# EAGLE design module_bga (EAGLE 9.3.0)

## Sheet 1 of 3
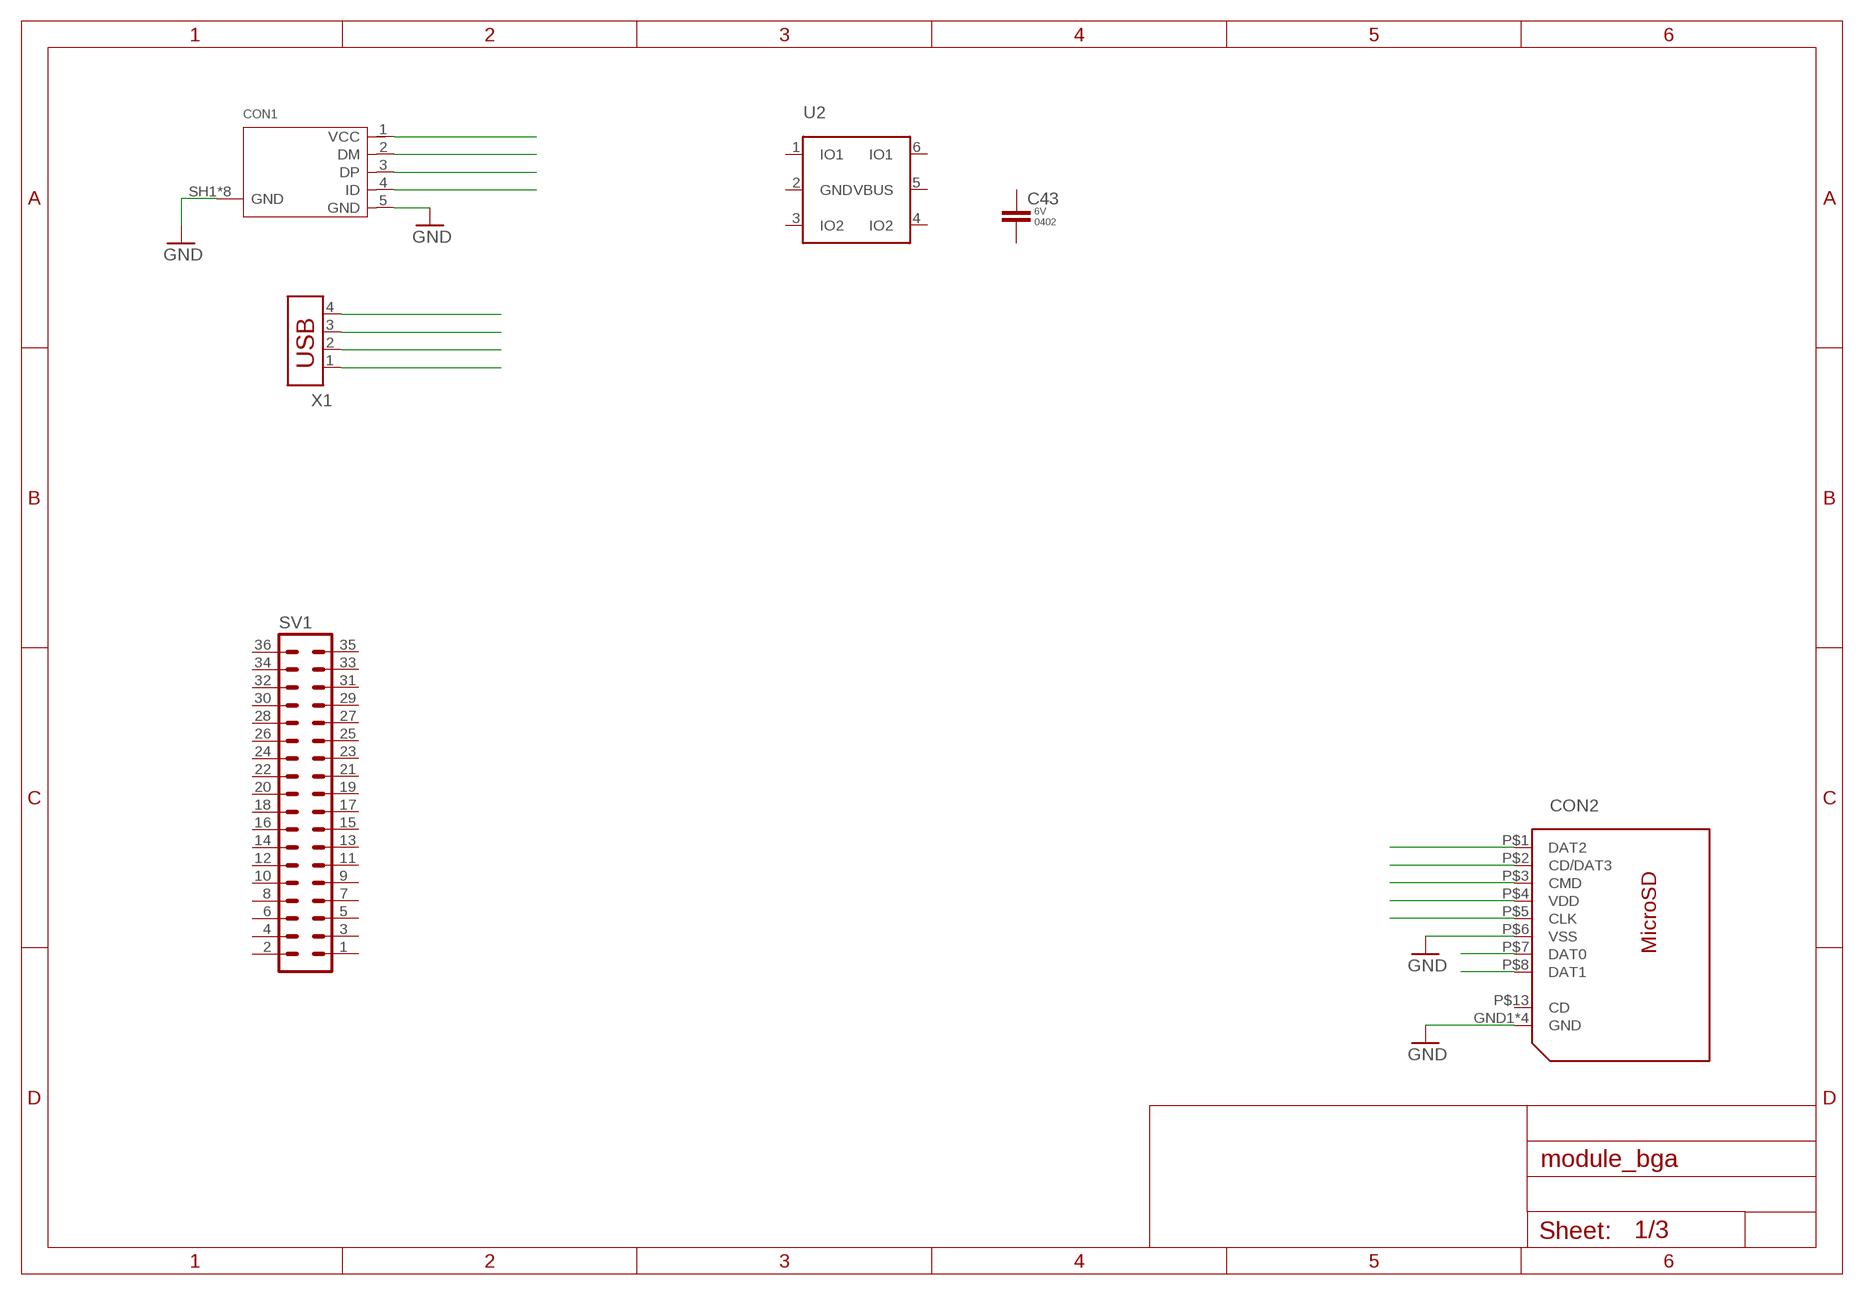
[diagram p0: schematic, sheet 1]

### Parts
C43  CAP-0402  [C0402K]
CON1  10118194-0001LF  [10118194]
CON2  112J-TXAR  [112J]
SV1  MA18-2  [MA18-2]
U2  USBLC6-2SC6  [SOT95P280X110-6]
X1  USB-787616  [USB]

### Nets
DAT0@7: CON2.P$7(DAT0)
DAT1@8: CON2.P$8(DAT1)
GND: CON1.5(GND) CON1.SH1(GND) CON1.SH2(GND) CON1.SH3(GND) CON1.SH4(GND) CON1.SH5(GND) CON1.SH6(GND) CON1.SH7(GND) CON1.SH8(GND) CON2.GND1(GND) CON2.GND2(GND) CON2.GND3(GND) CON2.GND4(GND) CON2.P$6(VSS) ; also sheet 2,3
N$4: CON1.4(ID)
N$5: CON1.3(DP)
N$6: CON1.2(DM)
N$7: CON1.1(VCC)
N$8: X1.1
N$9: X1.2
N$10: X1.3
N$11: X1.4
N$12: CON2.P$4(VDD)
N$13: CON2.P$1(DAT2)
N$14: CON2.P$2(CD/DAT3)
N$15: CON2.P$3(CMD)
N$16: CON2.P$5(CLK)
Unconnected: C43.1 C43.2 CON2.P$13(CD) SV1.1 SV1.2 SV1.3 SV1.4 SV1.5 SV1.6 SV1.7 SV1.8 SV1.9 SV1.10 SV1.11 SV1.12 SV1.13 SV1.14 SV1.15 SV1.16 SV1.17 SV1.18 SV1.19 SV1.20 SV1.21 SV1.22 SV1.23 SV1.24 SV1.25 SV1.26 SV1.27 SV1.28 SV1.29 SV1.30 SV1.31 SV1.32 SV1.33 SV1.34 SV1.35 SV1.36 U2.1(IO1) U2.2(GND) U2.3(IO2) U2.4(IO2) U2.5(VBUS) U2.6(IO1)

## Sheet 2 of 3
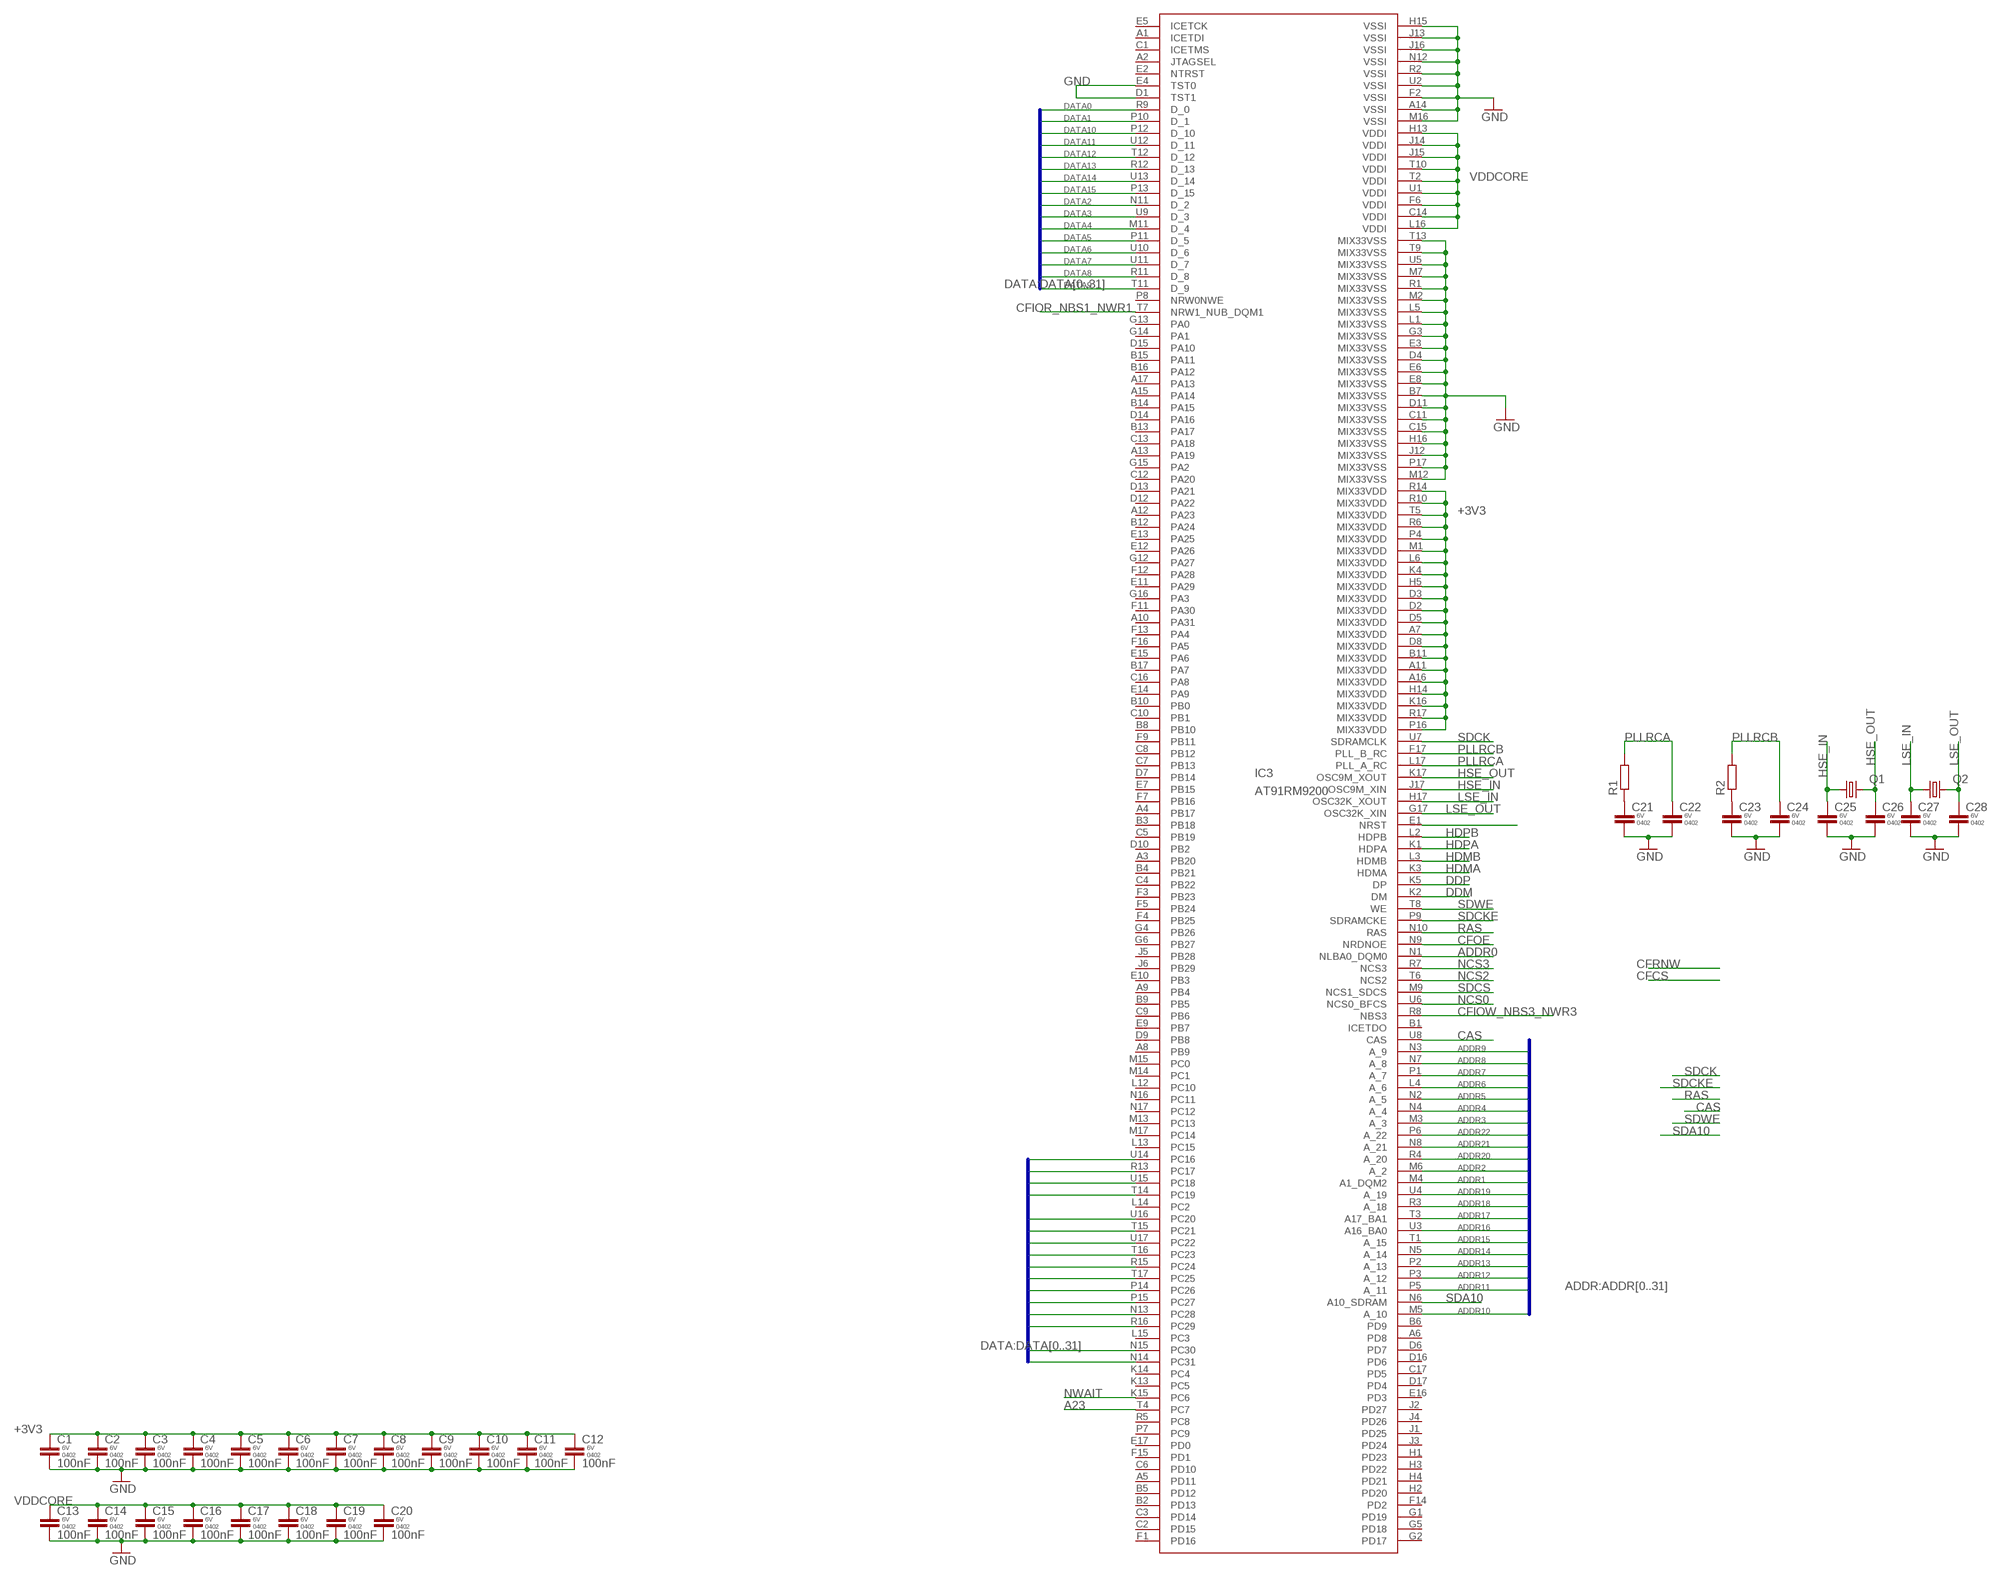
[diagram p1: schematic, sheet 2]

### Parts
C1  100nF  CAP-0402  [C0402K]
C2  100nF  CAP-0402  [C0402K]
C3  100nF  CAP-0402  [C0402K]
C4  100nF  CAP-0402  [C0402K]
C5  100nF  CAP-0402  [C0402K]
C6  100nF  CAP-0402  [C0402K]
C7  100nF  CAP-0402  [C0402K]
C8  100nF  CAP-0402  [C0402K]
C9  100nF  CAP-0402  [C0402K]
C10  100nF  CAP-0402  [C0402K]
C11  100nF  CAP-0402  [C0402K]
C12  100nF  CAP-0402  [C0402K]
C13  100nF  CAP-0402  [C0402K]
C14  100nF  CAP-0402  [C0402K]
C15  100nF  CAP-0402  [C0402K]
C16  100nF  CAP-0402  [C0402K]
C17  100nF  CAP-0402  [C0402K]
C18  100nF  CAP-0402  [C0402K]
C19  100nF  CAP-0402  [C0402K]
C20  100nF  CAP-0402  [C0402K]
C21  CAP-0402  [C0402K]
C22  CAP-0402  [C0402K]
C23  CAP-0402  [C0402K]
C24  CAP-0402  [C0402K]
C25  CAP-0402  [C0402K]
C26  CAP-0402  [C0402K]
C27  CAP-0402  [C0402K]
C28  CAP-0402  [C0402K]
IC3  AT91RM9200  [LFBGA256_A_291X326]
Q1  KX-7  [3.2X2.5_KX-7]
Q2  KX-327-NHF  [3.2X1.5]
R1  R-EU_R0402  [R0402]
R2  R-EU_R0402  [R0402]

### Nets
+3V3: C1.1 C2.1 C3.1 C4.1 C5.1 C6.1 C7.1 C8.1 C9.1 C10.1 C11.1 C12.1 IC3.A7(MIX33VDD) IC3.A11(MIX33VDD) IC3.A16(MIX33VDD) IC3.B11(MIX33VDD) IC3.D2(MIX33VDD) IC3.D3(MIX33VDD) IC3.D5(MIX33VDD) IC3.D8(MIX33VDD) IC3.H5(MIX33VDD) IC3.H14(MIX33VDD) IC3.K4(MIX33VDD) IC3.K16(MIX33VDD) IC3.L6(MIX33VDD) IC3.M1(MIX33VDD) IC3.P4(MIX33VDD) IC3.P16(MIX33VDD) IC3.R6(MIX33VDD) IC3.R10(MIX33VDD) IC3.R14(MIX33VDD) IC3.R17(MIX33VDD) IC3.T5(MIX33VDD) ; also sheet 3
A23: IC3.T4(PC7)
ADDR0: IC3.N1(NLBA0_DQM0) ; also sheet 3
ADDR1: IC3.M4(A1_DQM2) ; also sheet 3
ADDR2: IC3.M6(A_2) ; also sheet 3
ADDR3: IC3.M3(A_3) ; also sheet 3
ADDR4: IC3.N4(A_4) ; also sheet 3
ADDR5: IC3.N2(A_5) ; also sheet 3
ADDR6: IC3.L4(A_6) ; also sheet 3
ADDR7: IC3.P1(A_7) ; also sheet 3
ADDR8: IC3.N7(A_8) ; also sheet 3
ADDR9: IC3.N3(A_9) ; also sheet 3
ADDR10: IC3.M5(A_10) ; also sheet 3
ADDR11: IC3.P5(A_11) ; also sheet 3
ADDR12: IC3.P3(A_12)
ADDR13: IC3.P2(A_13) ; also sheet 3
ADDR14: IC3.N5(A_14) ; also sheet 3
ADDR15: IC3.T1(A_15)
ADDR16: IC3.U3(A16_BA0) ; also sheet 3
ADDR17: IC3.T3(A17_BA1) ; also sheet 3
ADDR18: IC3.R3(A_18)
ADDR19: IC3.U4(A_19)
ADDR20: IC3.R4(A_20)
ADDR21: IC3.N8(A_21)
ADDR22: IC3.P6(A_22)
CAS: IC3.U8(CAS) ; also sheet 3
CFIOR_NBS1_NWR1: IC3.T7(NRW1_NUB_DQM1) ; also sheet 3
CFIOW_NBS3_NWR3: IC3.R8(NBS3) ; also sheet 3
CFOE: IC3.N9(NRDNOE)
DATA0: IC3.R9(D_0) ; also sheet 3
DATA1: IC3.P10(D_1) ; also sheet 3
DATA2: IC3.N11(D_2) ; also sheet 3
DATA3: IC3.U9(D_3) ; also sheet 3
DATA4: IC3.M11(D_4) ; also sheet 3
DATA5: IC3.P11(D_5) ; also sheet 3
DATA6: IC3.U10(D_6) ; also sheet 3
DATA7: IC3.U11(D_7) ; also sheet 3
DATA8: IC3.R11(D_8) ; also sheet 3
DATA9: IC3.T11(D_9) ; also sheet 3
DATA10: IC3.P12(D_10) ; also sheet 3
DATA11: IC3.U12(D_11) ; also sheet 3
DATA12: IC3.T12(D_12) ; also sheet 3
DATA13: IC3.R12(D_13) ; also sheet 3
DATA14: IC3.U13(D_14) ; also sheet 3
DATA15: IC3.P13(D_15) ; also sheet 3
DATA16: IC3.U14(PC16) ; also sheet 3
DATA17: IC3.R13(PC17) ; also sheet 3
DATA18: IC3.U15(PC18) ; also sheet 3
DATA19: IC3.T14(PC19) ; also sheet 3
DATA20: IC3.U16(PC20) ; also sheet 3
DATA21: IC3.T15(PC21) ; also sheet 3
DATA22: IC3.U17(PC22) ; also sheet 3
DATA23: IC3.T16(PC23) ; also sheet 3
DATA24: IC3.R15(PC24) ; also sheet 3
DATA25: IC3.T17(PC25) ; also sheet 3
DATA26: IC3.P14(PC26) ; also sheet 3
DATA27: IC3.P15(PC27) ; also sheet 3
DATA28: IC3.N13(PC28) ; also sheet 3
DATA29: IC3.R16(PC29) ; also sheet 3
DATA30: IC3.N15(PC30) ; also sheet 3
DATA31: IC3.N14(PC31) ; also sheet 3
DDM: IC3.K2(DM)
DDP: IC3.K5(DP)
GND: C1.2 C2.2 C3.2 C4.2 C5.2 C6.2 C7.2 C8.2 C9.2 C10.2 C11.2 C12.2 C13.2 C14.2 C15.2 C16.2 C17.2 C18.2 C19.2 C20.2 C21.2 C22.2 C23.2 C24.2 C25.2 C26.2 C27.2 C28.2 IC3.A14(VSSI) IC3.B7(MIX33VSS) IC3.C11(MIX33VSS) IC3.C15(MIX33VSS) IC3.D1(TST1) IC3.D4(MIX33VSS) IC3.D11(MIX33VSS) IC3.E3(MIX33VSS) IC3.E4(TST0) IC3.E6(MIX33VSS) IC3.E8(MIX33VSS) IC3.F2(VSSI) IC3.G3(MIX33VSS) IC3.H15(VSSI) IC3.H16(MIX33VSS) IC3.J12(MIX33VSS) IC3.J13(VSSI) IC3.J16(VSSI) IC3.L1(MIX33VSS) IC3.L5(MIX33VSS) IC3.M2(MIX33VSS) IC3.M7(MIX33VSS) IC3.M12(MIX33VSS) IC3.M16(VSSI) IC3.N12(VSSI) IC3.P17(MIX33VSS) IC3.R1(MIX33VSS) IC3.R2(VSSI) IC3.T9(MIX33VSS) IC3.T13(MIX33VSS) IC3.U2(VSSI) IC3.U5(MIX33VSS) ; also sheet 1,3
HDMA: IC3.K3(HDMA)
HDMB: IC3.L3(HDMB)
HDPA: IC3.K1(HDPA)
HDPB: IC3.L2(HDPB)
HSE_IN: C25.1 IC3.J17(OSC9M_XIN) Q1.1
HSE_OUT: C26.1 IC3.K17(OSC9M_XOUT) Q1.3
LSE_IN: C27.1 IC3.H17(OSC32K_XOUT) Q2.1
LSE_OUT: C28.1 IC3.G17(OSC32K_XIN) Q2.2
N$1: C21.1 R1.1
N$2: C23.1 R2.1
N$3: IC3.E1(NRST)
NCS0: IC3.U6(NCS0_BFCS)
NCS2: IC3.T6(NCS2)
NCS3: IC3.R7(NCS3)
NWAIT: IC3.K15(PC6)
PLLRCA: C22.1 IC3.L17(PLL_A_RC) R1.2
PLLRCB: C24.1 IC3.F17(PLL_B_RC) R2.2
RAS: IC3.N10(RAS) ; also sheet 3
SDA10: IC3.N6(A10_SDRAM) ; also sheet 3
SDCK: IC3.U7(SDRAMCLK) ; also sheet 3
SDCKE: IC3.P9(SDRAMCKE) ; also sheet 3
SDCS: IC3.M9(NCS1_SDCS) ; also sheet 3
SDWE: IC3.T8(WE) ; also sheet 3
VDDCORE: C13.1 C14.1 C15.1 C16.1 C17.1 C18.1 C19.1 C20.1 IC3.C14(VDDI) IC3.F6(VDDI) IC3.H13(VDDI) IC3.J14(VDDI) IC3.J15(VDDI) IC3.L16(VDDI) IC3.T2(VDDI) IC3.T10(VDDI) IC3.U1(VDDI)
Unconnected: IC3.A1(ICETDI) IC3.A2(JTAGSEL) IC3.A3(PB20) IC3.A4(PB17) IC3.A5(PD11) IC3.A6(PD8) IC3.A8(PB9) IC3.A9(PB4) IC3.A10(PA31) IC3.A12(PA23) IC3.A13(PA19) IC3.A15(PA14) IC3.A17(PA13) IC3.B1(ICETDO) IC3.B2(PD13) IC3.B3(PB18) IC3.B4(PB21) IC3.B5(PD12) IC3.B6(PD9) IC3.B8(PB10) IC3.B9(PB5) IC3.B10(PB0) IC3.B12(PA24) IC3.B13(PA17) IC3.B14(PA15) IC3.B15(PA11) IC3.B16(PA12) IC3.B17(PA7) IC3.C1(ICETMS) IC3.C2(PD15) IC3.C3(PD14) IC3.C4(PB22) IC3.C5(PB19) IC3.C6(PD10) IC3.C7(PB13) IC3.C8(PB12) IC3.C9(PB6) IC3.C10(PB1) IC3.C12(PA20) IC3.C13(PA18) IC3.C16(PA8) IC3.C17(PD5) IC3.D6(PD7) IC3.D7(PB14) IC3.D9(PB8) IC3.D10(PB2) IC3.D12(PA22) IC3.D13(PA21) IC3.D14(PA16) IC3.D15(PA10) IC3.D16(PD6) IC3.D17(PD4) IC3.E2(NTRST) IC3.E5(ICETCK) IC3.E7(PB15) IC3.E9(PB7) IC3.E10(PB3) IC3.E11(PA29) IC3.E12(PA26) IC3.E13(PA25) IC3.E14(PA9) IC3.E15(PA6) IC3.E16(PD3) IC3.E17(PD0) IC3.F1(PD16) IC3.F3(PB23) IC3.F4(PB25) IC3.F5(PB24) IC3.F7(PB16) IC3.F9(PB11) IC3.F11(PA30) IC3.F12(PA28) IC3.F13(PA4) IC3.F14(PD2) IC3.F15(PD1) IC3.F16(PA5) IC3.G1(PD19) IC3.G2(PD17) IC3.G4(PB26) IC3.G5(PD18) IC3.G6(PB27) IC3.G12(PA27) IC3.G13(PA0) IC3.G14(PA1) IC3.G15(PA2) IC3.G16(PA3) IC3.H1(PD23) IC3.H2(PD20) IC3.H3(PD22) IC3.H4(PD21) IC3.J1(PD25) IC3.J2(PD27) IC3.J3(PD24) IC3.J4(PD26) IC3.J5(PB28) IC3.J6(PB29) IC3.K13(PC5) IC3.K14(PC4) IC3.L12(PC10) IC3.L13(PC15) IC3.L14(PC2) IC3.L15(PC3) IC3.M13(PC13) IC3.M14(PC1) IC3.M15(PC0) IC3.M17(PC14) IC3.N16(PC11) IC3.N17(PC12) IC3.P7(PC9) IC3.P8(NRW0NWE) IC3.R5(PC8)

### Buses
ADDR:ADDR[0..31]
DATA:DATA[0..31]

## Sheet 3 of 3
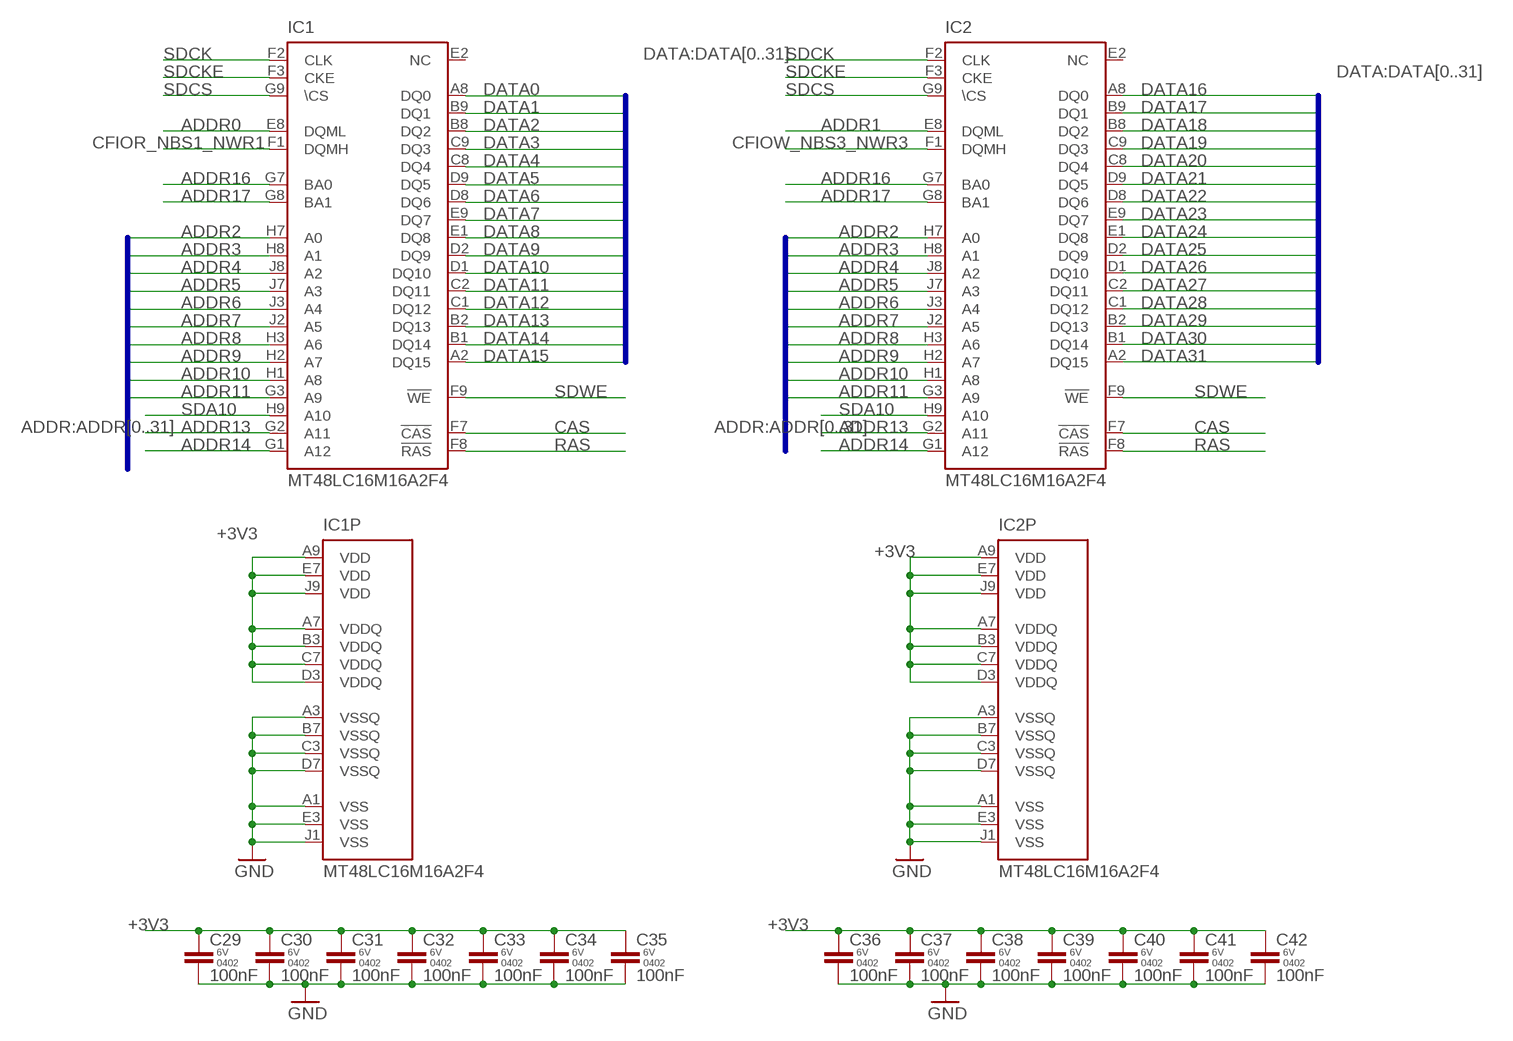
[diagram p2: schematic, sheet 3]

### Parts
C29  100nF  CAP-0402  [C0402K]
C30  100nF  CAP-0402  [C0402K]
C31  100nF  CAP-0402  [C0402K]
C32  100nF  CAP-0402  [C0402K]
C33  100nF  CAP-0402  [C0402K]
C34  100nF  CAP-0402  [C0402K]
C35  100nF  CAP-0402  [C0402K]
C36  100nF  CAP-0402  [C0402K]
C37  100nF  CAP-0402  [C0402K]
C38  100nF  CAP-0402  [C0402K]
C39  100nF  CAP-0402  [C0402K]
C40  100nF  CAP-0402  [C0402K]
C41  100nF  CAP-0402  [C0402K]
C42  100nF  CAP-0402  [C0402K]
IC1  MT48LC16M16A2F4  [BGA81C80P9X9_800X800X100]
IC2  MT48LC16M16A2F4  [BGA81C80P9X9_800X800X100]

### Nets
+3V3: C29.1 C30.1 C31.1 C32.1 C33.1 C34.1 C35.1 C36.1 C37.1 C38.1 C39.1 C40.1 C41.1 C42.1 IC1.A7(VDDQ) IC1.A9(VDD) IC1.B3(VDDQ) IC1.C7(VDDQ) IC1.D3(VDDQ) IC1.E7(VDD) IC1.J9(VDD) IC2.A7(VDDQ) IC2.A9(VDD) IC2.B3(VDDQ) IC2.C7(VDDQ) IC2.D3(VDDQ) IC2.E7(VDD) IC2.J9(VDD) ; also sheet 2
ADDR0: IC1.E8(DQML) ; also sheet 2
ADDR1: IC2.E8(DQML) ; also sheet 2
ADDR2: IC1.H7(A0) IC2.H7(A0) ; also sheet 2
ADDR3: IC1.H8(A1) IC2.H8(A1) ; also sheet 2
ADDR4: IC1.J8(A2) IC2.J8(A2) ; also sheet 2
ADDR5: IC1.J7(A3) IC2.J7(A3) ; also sheet 2
ADDR6: IC1.J3(A4) IC2.J3(A4) ; also sheet 2
ADDR7: IC1.J2(A5) IC2.J2(A5) ; also sheet 2
ADDR8: IC1.H3(A6) IC2.H3(A6) ; also sheet 2
ADDR9: IC1.H2(A7) IC2.H2(A7) ; also sheet 2
ADDR10: IC1.H1(A8) IC2.H1(A8) ; also sheet 2
ADDR11: IC1.G3(A9) IC2.G3(A9) ; also sheet 2
ADDR13: IC1.G2(A11) IC2.G2(A11) ; also sheet 2
ADDR14: IC1.G1(A12) IC2.G1(A12) ; also sheet 2
ADDR16: IC1.G7(BA0) IC2.G7(BA0) ; also sheet 2
ADDR17: IC1.G8(BA1) IC2.G8(BA1) ; also sheet 2
CAS: IC1.F7(!CAS) IC2.F7(!CAS) ; also sheet 2
CFIOR_NBS1_NWR1: IC1.F1(DQMH) ; also sheet 2
CFIOW_NBS3_NWR3: IC2.F1(DQMH) ; also sheet 2
DATA0: IC1.A8(DQ0) ; also sheet 2
DATA1: IC1.B9(DQ1) ; also sheet 2
DATA2: IC1.B8(DQ2) ; also sheet 2
DATA3: IC1.C9(DQ3) ; also sheet 2
DATA4: IC1.C8(DQ4) ; also sheet 2
DATA5: IC1.D9(DQ5) ; also sheet 2
DATA6: IC1.D8(DQ6) ; also sheet 2
DATA7: IC1.E9(DQ7) ; also sheet 2
DATA8: IC1.E1(DQ8) ; also sheet 2
DATA9: IC1.D2(DQ9) ; also sheet 2
DATA10: IC1.D1(DQ10) ; also sheet 2
DATA11: IC1.C2(DQ11) ; also sheet 2
DATA12: IC1.C1(DQ12) ; also sheet 2
DATA13: IC1.B2(DQ13) ; also sheet 2
DATA14: IC1.B1(DQ14) ; also sheet 2
DATA15: IC1.A2(DQ15) ; also sheet 2
DATA16: IC2.A8(DQ0) ; also sheet 2
DATA17: IC2.B9(DQ1) ; also sheet 2
DATA18: IC2.B8(DQ2) ; also sheet 2
DATA19: IC2.C9(DQ3) ; also sheet 2
DATA20: IC2.C8(DQ4) ; also sheet 2
DATA21: IC2.D9(DQ5) ; also sheet 2
DATA22: IC2.D8(DQ6) ; also sheet 2
DATA23: IC2.E9(DQ7) ; also sheet 2
DATA24: IC2.E1(DQ8) ; also sheet 2
DATA25: IC2.D2(DQ9) ; also sheet 2
DATA26: IC2.D1(DQ10) ; also sheet 2
DATA27: IC2.C2(DQ11) ; also sheet 2
DATA28: IC2.C1(DQ12) ; also sheet 2
DATA29: IC2.B2(DQ13) ; also sheet 2
DATA30: IC2.B1(DQ14) ; also sheet 2
DATA31: IC2.A2(DQ15) ; also sheet 2
GND: C29.2 C30.2 C31.2 C32.2 C33.2 C34.2 C35.2 C36.2 C37.2 C38.2 C39.2 C40.2 C41.2 C42.2 IC1.A1(VSS) IC1.A3(VSSQ) IC1.B7(VSSQ) IC1.C3(VSSQ) IC1.D7(VSSQ) IC1.E3(VSS) IC1.J1(VSS) IC2.A1(VSS) IC2.A3(VSSQ) IC2.B7(VSSQ) IC2.C3(VSSQ) IC2.D7(VSSQ) IC2.E3(VSS) IC2.J1(VSS) ; also sheet 1,2
RAS: IC1.F8(!RAS) IC2.F8(!RAS) ; also sheet 2
SDA10: IC1.H9(A10) IC2.H9(A10) ; also sheet 2
SDCK: IC1.F2(CLK) IC2.F2(CLK) ; also sheet 2
SDCKE: IC1.F3(CKE) IC2.F3(CKE) ; also sheet 2
SDCS: IC1.G9(\CS) IC2.G9(\CS) ; also sheet 2
SDWE: IC1.F9(!WE) IC2.F9(!WE) ; also sheet 2
Unconnected: IC1.E2(NC) IC2.E2(NC)

### Buses
DATA:DATA[0..31]
ADDR:ADDR[0..31]

## Library data of the parts
C1-C43 = parts-passives:CAP-; PACKAGE: 0402; RATING: 6V
CON1 = parts-amphenol:10118194-00
CON2 = parts-attend:112J-TXAR
IC1 IC2 = parts-alliance_mem:MT48LC16M16A2: 256Mb: x16 SDRAM MT48LC16M16A2 - 4 Meg x 16 x 4 banks Source: http://download.micron.com/pdf/datasheets/dram/sdram/256MSDRAM.pdf
IC3 = parts-microchip:AT91RM9200: Auto generated by make-symbol-device-package(bsdl).ulp Source: at91rm9200_bga.bsd; MPN: AT91RM9200-EK; OC_FARNELL: 1629536; OC_NEWARK: 02P6234
Q1 = crystal-geyer_V1_0:KX: Quartz Crystals (MHz) SMD: KX - Serie Model Size l/w/h [mm] Frequency Range Frequency Stability Temp. Range [°C] Load Capacitance AECQ 200 availabel Datasheet KX-4 KX-5 KX-6 KX-7 KX-9A KX-9B KX-12A KX-12B KX-13 KX-20 KX-K KX-KS 1.6/1.2/0.3 2.0/1.6/0.45 2.5/2.0/0.55 3.2/2.5/0.8 5.0/3.2/1.0 5.0/3.2/1.1 6.0/3.5/1.1 6.0/3.5/1.0 7.0/5.0 /1.3 11.6/5.5/1.6 12.3/4.5/4.2 12.3/4.5/3.2 24.0 ~ 80.0 MHz 16.0 ~ 80.0 MHz 12.0 ~ 80.0 MHz 8.0 ~ 60.0 MHz 7,68 ~ 300,0 MHz 8,0 ~ 50,0 MHz 8,0 ~ 150,0 MHz 8,0 ~ 50,0 MHz 6,0 ~ 160,0 MHz 3,579 ~ 25,0 MHz 3,579 ~ 70,0 MHz 3,579 ~ 70,0 MHz ±10 … ±50ppm ±10 … ±50ppm ±10 … ±50ppm ±10 … ±50ppm ±10 … ±50ppm ±10 … ±50ppm ±10 … ±50ppm ±10 … ±50ppm ±10 … ±50ppm ±50ppm ±10 … ±50ppm ±10 … ±50ppm (*) -40°C …+85°C (*) -40°C …+125°C (*) -40°C …+125°C (*) -40°C …+125°C (*) -40°C …+105°C (*) -40°C …+105°C (*) -40°C …+125°C (*) -40°C …+105°C (*) -40°C …+105°C (*) -40°C …+105°C (*) -40°C …+85°C (*) -40°C …+85°C 8, 8…16 8, 8…16 10, 8…16 12, 7…20 16, 10…20 16, 10…20 16, 10…20 16, 12…20 16, 12…20 16, 12…20 16, 12…30 16, 12…30 - yes yes yes - - - - - - - - KX-4.pdf <http://www.geyer-electronic.de/uploads/tx_userartikelfrequenz/GEYER-KX-4.pdf> KX-5.pdf <http://www.geyer-electronic.de/uploads/tx_userartikelfrequenz/GEYER-KX-5.pdf> KX-6.pdf <http://www.geyer-electronic.de/uploads/tx_userartikelfrequenz/GEYER-KX-6.pdf> KX-7.pdf <http://www.geyer-electronic.de/uploads/tx_userartikelfrequenz/GEYER-KX-7.pdf> KX-9A.pdf <http://www.geyer-electronic.de/uploads/tx_userartikelfrequenz/GEYER-KX-9A.pdf> KX-9B.pdf <http://www.geyer-electronic.de/uploads/tx_userartikelfrequenz/GEYER-KX-9B.pdf> KX-12A.pdf <http://www.geyer-electronic.de/uploads/tx_userartikelfrequenz/GEYER-KX-12A.pdf> KX-12B.pdf <http://www.geyer-electronic.de/uploads/tx_userartikelfrequenz/GEYER-KX-12B.pdf> KX-13.pdf <http://www.geyer-electronic.de/uploads/tx_userartikelfrequenz/GEYER-KX-13.pdf> KX-20.pdf <http://www.geyer-electronic.de/uploads/tx_userartikelfrequenz/GEYER-KX-20.pdf> KX-K.pdf <http://www.geyer-electronic.de/uploads/tx_userartikelfrequenz/GEYER-KX-K.pdf> KX-KS.pdf <http://www.geyer-electronic.de/uploads/tx_userartikelfrequenz/GEYER-KX-KS.pdf> <http://www.geyer-electronic.de/fileadmin/template/img/logo-geyer-electronic.png> Details see: http://www.geyer-electronic.de/Frequenz-Produkte.9.0.html Created 2016-06-07, Hans Locher 2016 (C) Geyer Quartz Technology KX4,KX5,KX6,KX7,KX9A,KX9B,KX12A,KX12B,KX13,KX20,KXK,KXKS;1612;2016;2520;3225;5032;6035;7050;11655;12345;1,6x1,2;2,0x1,6;2,5x2,0;3,2x2,5;5,0x3,2;6,0x3,5;7,0x5,0;11,6x5,5;12,3x4,5;12,3x4,5;1.6x1.2;2.0x1.6;2.5x2.0;3.2x2.5;5.0x3.2;6.0x3.5;7.0x5.0;11.6x5.5;12.3x4.5;12.3x4.5;
Q2 = crystal-geyer_V1_0:KX-327: Tuning Fork Crystals (kHz) SMD: KX327 - Serie Model Size l/w/h [mm] Frequency Range Frequency Stability Temp. Range [°C] Load Capacitance AECQ 200 availabel Datasheet KX-327VT KX-327FT KX-327RT KX-327NHT KX-327NHF KX-327L KX-327S 1.25/1.05/0.5 1.6/1.0/0.5 2.0/1.2/0.6 3.2/1.5/0.8 3.2/1.5/0.8 7.0/1.5/1.4 8.2/3.8/2.5 32,768 kHz 32,768 kHz 32,768 kHz 32,768 kHz 32,768 kHz 32,768 kHz 32,768 kHz ±10 … ±20ppm ±10 … ±20ppm ±10 … ±20ppm ±10 … ±20ppm ±10 … ±20ppm ±10 … ±20ppm ±5 … ±20ppm (*) -40°C …+85°C (*) -40°C …+85°C (*) -40°C …+85°C (*) -40°C …+85°C (*) -40°C …+125°C (*) -40°C …+85°C (*) -40°C …+85°C 7/9/12,5 7/9/12,5 7/9/12,6 7/9/12,5 9/12,5 7/9/12,5 6/12,5 - - - - yes - - KX-327VT.pdf <http://www.geyer-electronic.de/uploads/tx_userartikelfrequenz/GEYER-KX-327VT.pdf> KX-327FT.pdf <http://www.geyer-electronic.de/uploads/tx_userartikelfrequenz/GEYER-KX-327FT.pdf> KX-327RT.pdf <http://www.geyer-electronic.de/uploads/tx_userartikelfrequenz/GEYER-KX-327RT.pdf> KX-327NHT.pdf <http://www.geyer-electronic.de/uploads/tx_userartikelfrequenz/GEYER-KX-327NHT.pdf> KX-327NHF.pdf <http://www.geyer-electronic.de/uploads/tx_userartikelfrequenz/GEYER-KX-327NHF.pdf> KX-327L.pdf <http://www.geyer-electronic.de/uploads/tx_userartikelfrequenz/GEYER-KX-327L.pdf> KX-327S.pdf <http://www.geyer-electronic.de/uploads/tx_userartikelfrequenz/GEYER-KX-327S.pdf> <http://www.geyer-electronic.de/fileadmin/template/img/logo-geyer-electronic.png> Details see: http://www.geyer-electronic.de/Frequenz-Produkte.9.0.html Created 2016-06-07, Hans Locher 2016 (C) Geyer Quartz Technology KX327VT,KX327FT,KX327RT,KX327NHT,KX327NHF,KX327S,KX327L;125105;1610;2012;3215;7015;8238;1,25x1,05,1.25x1.05;1,6x1,0,1.6x1.0;2,0x1,2,2.0x1.2;3,2x1,5,3.2x1.5;8,2x3,8,8.2x3.8,7.0x1.5,7,0x1,532.768kHz
R1 R2 = rcl:R-EU_: RESISTOR, European symbol; SPICEPREFIX: R
SV1 = con-lstb:MA18-2: PIN HEADER; OC_FARNELL: unknown; OC_NEWARK: unknown
U2 = parts-st:USBLC6-2
X1 = con-amp:USB-787616: AMP connector

## Board
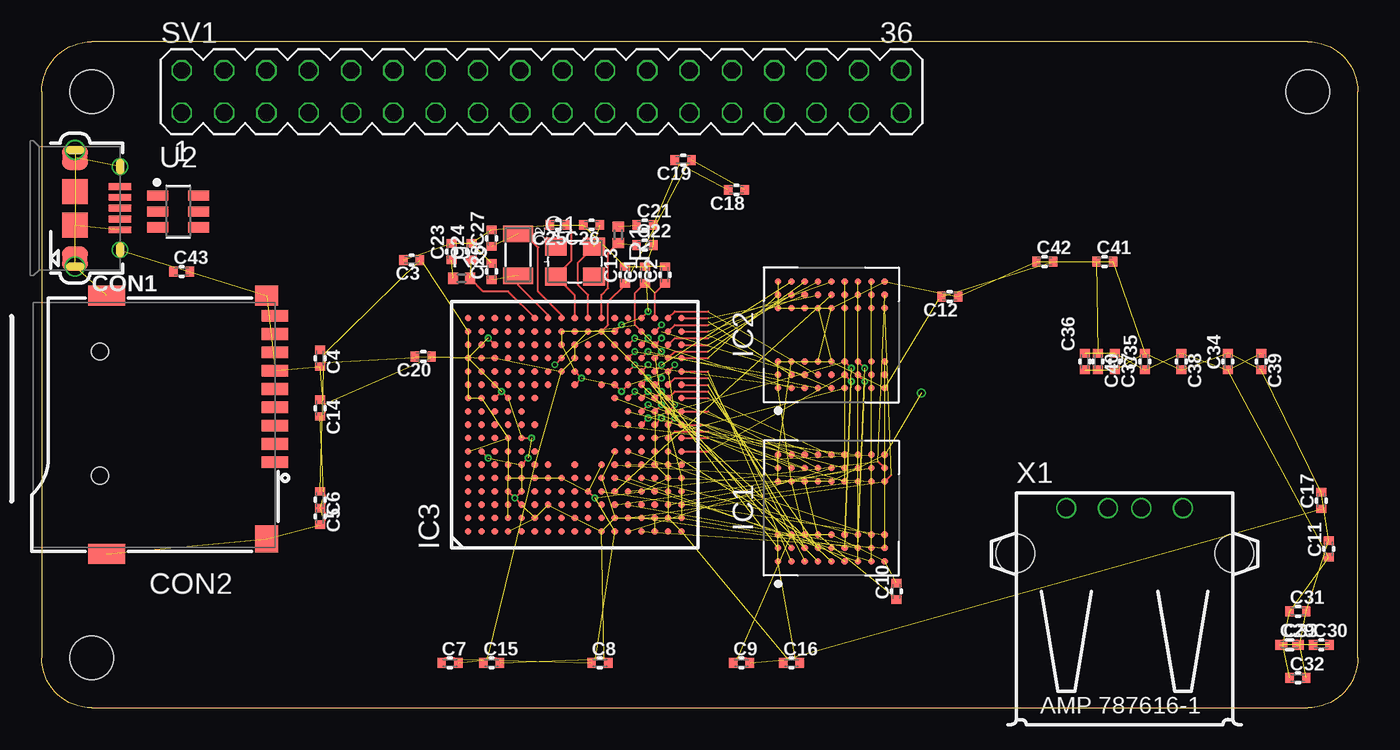
[diagram p3: board, top side]
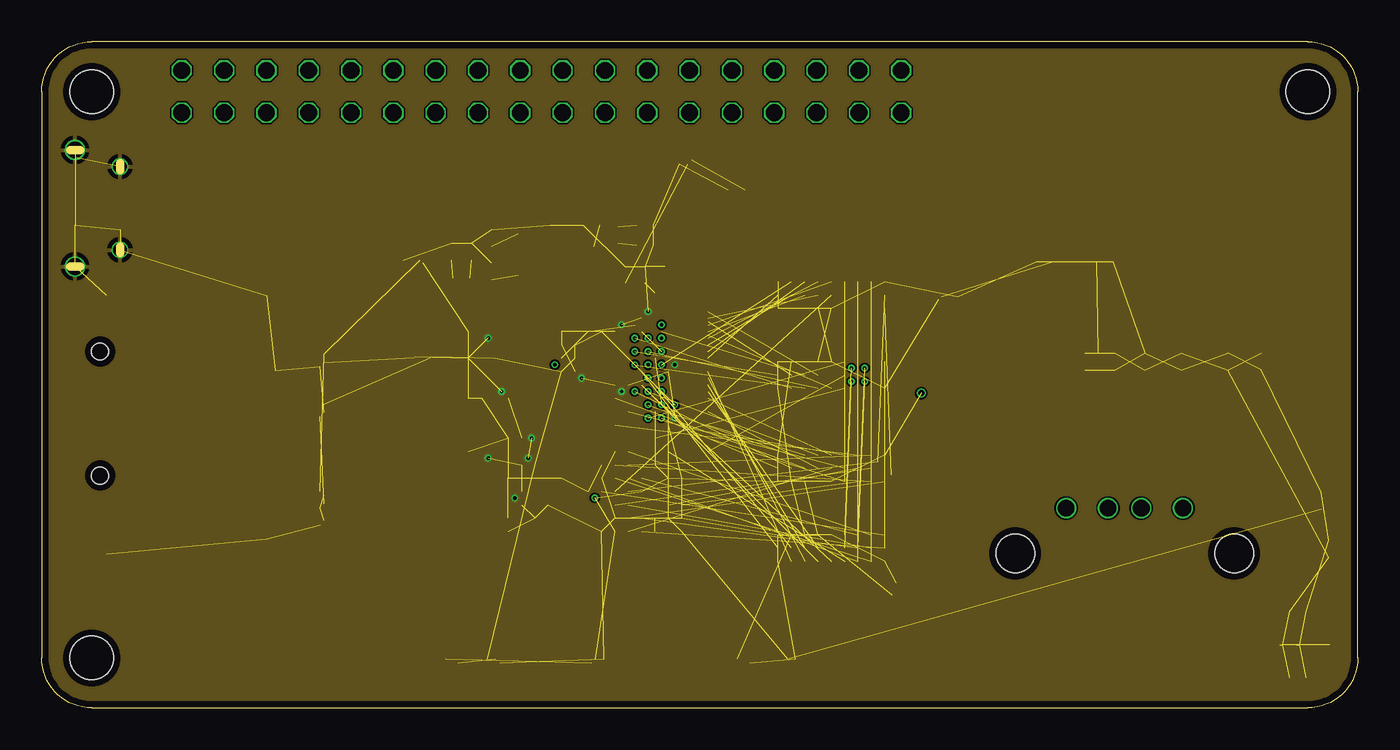
[diagram p4: board, inner layer Route2]
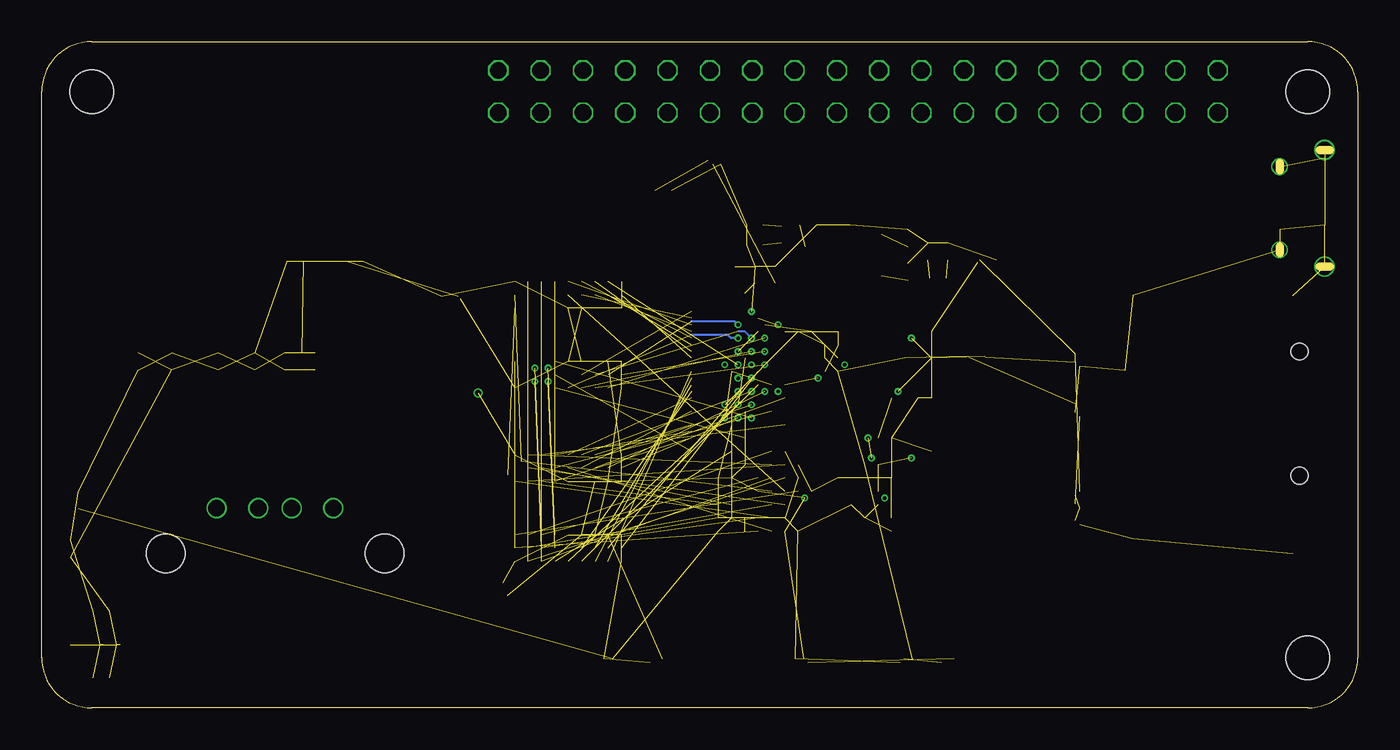
[diagram p5: board, bottom side, seen from below]

Size 79 x 40 mm. Coordinates in mm from the lower left corner, seen from the top.
Outline: 3,0 76,0 arc90 79,3 79,37 arc90 76,40 3,40 arc90 0,37 0,3 arc90 3,0
Copper layers (1+2*15+16): Top 0.035mm / dielectric 0.2mm / Route2 0.0175mm / dielectric 0.465mm / Route15 0.0175mm / dielectric 0.2mm / Bottom 0.035mm
Design rules "default *": minimum track width 4mil, minimum drill 0.2mm, track to track 4mil, track to pad 4mil, pad to pad 4mil, via to via 4mil, smd to smd 4mil, copper to edge 0.4mm, drill to drill 6mil, minimum pad ring 4mil, minimum via ring 4mil, stop-mask expansion 0.1mm, vias tented up to drill 0.3mm, thermal gap 10mil
Holes 2.6 mm at 3,37 3,3 76,37
tRestrict: area 0,34 to 6,40; area 0,0 to 6,6; area 73,34 to 79,40
bRestrict: area 0,34 to 6,40; area 0,0 to 6,6; area 73,34 to 79,40

### Footprints (pad centres in the part's own frame; a part is rotated, then mirrored left to right if it is on the bottom)
C0402K = smd 0.5 x 0.6: 1 -0.5,0; 2 0.5,0
10118194 = smd 0.4 x 1.35: 1 -1.3,2.7; 2 -0.65,2.7; 3 0,2.7; 4 0.65,2.7; 5 1.3,2.7 | drill 0.8: SH1 -2.5,2.7; SH2 2.5,2.7 | drill 1: SH3 -3.5,0; SH8 3.5,0 | smd 1.5 x 1.55: SH4 -3.05,0; SH5 -1,0; SH6 1,0; SH7 3.05,0
112J = smd 1.2 x 1.4: GND1 -7.75,-0.5 | smd 1.2 x 2.2: GND2 -7.75,-10.1; GND3 7.75,-10.1 | smd 1.6 x 1.4: GND4 6.85,-0.5 | smd 0.7 x 1.6: P$1 2.25,0; P$2 1.15,0; P$3 0.05,0; P$4 -1.05,0; P$5 -2.15,0; P$6 -3.25,0; P$7 -4.35,0; P$8 -5.45,0; P$13 -6.55,0 | hole 1: -4.4,-10.5; 3.05,-10.5
BGA81C80P9X9_800X800X100 = smd 0.4 x 0.4: A1 -3.2,3.2; A2 -2.4,3.2; A3 -1.6,3.2; A7 1.6,3.2; A8 2.4,3.2; A9 3.2,3.2; B1 -3.2,2.4; B2 -2.4,2.4; B3 -1.6,2.4; B7 1.6,2.4; B8 2.4,2.4; B9 3.2,2.4; C1 -3.2,1.6; C2 -2.4,1.6; C3 -1.6,1.6; C7 1.6,1.6; C8 2.4,1.6; C9 3.2,1.6; D1 -3.2,0.8; D2 -2.4,0.8; D3 -1.6,0.8; D7 1.6,0.8; D8 2.4,0.8; D9 3.2,0.8; E1 -3.2,0; E2 -2.4,0; E3 -1.6,0; E7 1.6,0; E8 2.4,0; E9 3.2,0; F1 -3.2,-0.8; F2 -2.4,-0.8; F3 -1.6,-0.8; F7 1.6,-0.8; F8 2.4,-0.8; F9 3.2,-0.8; G1 -3.2,-1.6; G2 -2.4,-1.6; G3 -1.6,-1.6; G7 1.6,-1.6; G8 2.4,-1.6; G9 3.2,-1.6; H1 -3.2,-2.4; H2 -2.4,-2.4; H3 -1.6,-2.4; H7 1.6,-2.4; H8 2.4,-2.4; H9 3.2,-2.4; J1 -3.2,-3.2; J2 -2.4,-3.2; J3 -1.6,-3.2; J7 1.6,-3.2; J8 2.4,-3.2; J9 3.2,-3.2
LFBGA256_A_291X326 = smd 0.4 x 0.4: A1 -6.4,6.4; A2 -5.6,6.4; A3 -4.8,6.4; A4 -4,6.4; A5 -3.2,6.4; A6 -2.4,6.4; A7 -1.6,6.4; A8 -0.8,6.4; A9 0,6.4; A10 0.8,6.4; A11 1.6,6.4; A12 2.4,6.4; A13 3.2,6.4; A14 4,6.4; A15 4.8,6.4; A16 5.6,6.4; A17 6.4,6.4; B1 -6.4,5.6; B2 -5.6,5.6; B3 -4.8,5.6; B4 -4,5.6; B5 -3.2,5.6; B6 -2.4,5.6; B7 -1.6,5.6; B8 -0.8,5.6; B9 0,5.6; B10 0.8,5.6; B11 1.6,5.6; B12 2.4,5.6; B13 3.2,5.6; B14 4,5.6; B15 4.8,5.6; B16 5.6,5.6; B17 6.4,5.6; C1 -6.4,4.8; C2 -5.6,4.8; C3 -4.8,4.8; C4 -4,4.8; C5 -3.2,4.8; C6 -2.4,4.8; C7 -1.6,4.8; C8 -0.8,4.8; C9 0,4.8; C10 0.8,4.8; C11 1.6,4.8; C12 2.4,4.8; C13 3.2,4.8; C14 4,4.8; C15 4.8,4.8; C16 5.6,4.8; C17 6.4,4.8; D1 -6.4,4; D2 -5.6,4; D3 -4.8,4; D4 -4,4; D5 -3.2,4; D6 -2.4,4; D7 -1.6,4; D8 -0.8,4; D9 0,4; D10 0.8,4; D11 1.6,4; D12 2.4,4; D13 3.2,4; D14 4,4; D15 4.8,4; D16 5.6,4; D17 6.4,4; E1 -6.4,3.2; E2 -5.6,3.2; E3 -4.8,3.2; E4 -4,3.2; E5 -3.2,3.2; E6 -2.4,3.2; E7 -1.6,3.2; E8 -0.8,3.2; E9 0,3.2; E10 0.8,3.2; E11 1.6,3.2; E12 2.4,3.2; E13 3.2,3.2; E14 4,3.2; E15 4.8,3.2; E16 5.6,3.2; E17 6.4,3.2; F1 -6.4,2.4; F2 -5.6,2.4; F3 -4.8,2.4; F4 -4,2.4; F5 -3.2,2.4; F6 -2.4,2.4; F7 -1.6,2.4; F9 0,2.4; F11 1.6,2.4; F12 2.4,2.4; F13 3.2,2.4; F14 4,2.4; F15 4.8,2.4; F16 5.6,2.4; F17 6.4,2.4; G1 -6.4,1.6; G2 -5.6,1.6; G3 -4.8,1.6; G4 -4,1.6; G5 -3.2,1.6; G6 -2.4,1.6; G12 2.4,1.6; G13 3.2,1.6; G14 4,1.6; G15 4.8,1.6; G16 5.6,1.6; G17 6.4,1.6; H1 -6.4,0.8; H2 -5.6,0.8; H3 -4.8,0.8; H4 -4,0.8; H5 -3.2,0.8; H13 3.2,0.8; H14 4,0.8; H15 4.8,0.8; H16 5.6,0.8; H17 6.4,0.8; J1 -6.4,0; J2 -5.6,0; J3 -4.8,0; J4 -4,0; J5 -3.2,0; J6 -2.4,0; J12 2.4,0; J13 3.2,0; J14 4,0; J15 4.8,0; J16 5.6,0; J17 6.4,0; K1 -6.4,-0.8; K2 -5.6,-0.8; K3 -4.8,-0.8; K4 -4,-0.8; K5 -3.2,-0.8; K13 3.2,-0.8; K14 4,-0.8; K15 4.8,-0.8; K16 5.6,-0.8; K17 6.4,-0.8; L1 -6.4,-1.6; L2 -5.6,-1.6; L3 -4.8,-1.6; L4 -4,-1.6; L5 -3.2,-1.6; L6 -2.4,-1.6; L12 2.4,-1.6; L13 3.2,-1.6; L14 4,-1.6; L15 4.8,-1.6; L16 5.6,-1.6; L17 6.4,-1.6; M1 -6.4,-2.4; M2 -5.6,-2.4; M3 -4.8,-2.4; M4 -4,-2.4; M5 -3.2,-2.4; M6 -2.4,-2.4; M7 -1.6,-2.4; M9 0,-2.4; M11 1.6,-2.4; M12 2.4,-2.4; M13 3.2,-2.4; M14 4,-2.4; M15 4.8,-2.4; M16 5.6,-2.4; M17 6.4,-2.4; N1 -6.4,-3.2; N2 -5.6,-3.2; N3 -4.8,-3.2; N4 -4,-3.2; N5 -3.2,-3.2; N6 -2.4,-3.2; N7 -1.6,-3.2; N8 -0.8,-3.2; N9 0,-3.2; N10 0.8,-3.2; N11 1.6,-3.2; N12 2.4,-3.2; N13 3.2,-3.2; N14 4,-3.2; N15 4.8,-3.2; N16 5.6,-3.2; N17 6.4,-3.2; P1 -6.4,-4; P2 -5.6,-4; P3 -4.8,-4; P4 -4,-4; P5 -3.2,-4; P6 -2.4,-4; P7 -1.6,-4; P8 -0.8,-4; P9 0,-4; P10 0.8,-4; P11 1.6,-4; P12 2.4,-4; P13 3.2,-4; P14 4,-4; P15 4.8,-4; P16 5.6,-4; P17 6.4,-4; R1 -6.4,-4.8; R2 -5.6,-4.8; R3 -4.8,-4.8; R4 -4,-4.8; R5 -3.2,-4.8; R6 -2.4,-4.8; R7 -1.6,-4.8; R8 -0.8,-4.8; R9 0,-4.8; R10 0.8,-4.8; R11 1.6,-4.8; R12 2.4,-4.8; R13 3.2,-4.8; R14 4,-4.8; R15 4.8,-4.8; R16 5.6,-4.8; R17 6.4,-4.8; T1 -6.4,-5.6; T2 -5.6,-5.6; T3 -4.8,-5.6; T4 -4,-5.6; T5 -3.2,-5.6; T6 -2.4,-5.6; T7 -1.6,-5.6; T8 -0.8,-5.6; T9 0,-5.6; T10 0.8,-5.6; T11 1.6,-5.6; T12 2.4,-5.6; T13 3.2,-5.6; T14 4,-5.6; T15 4.8,-5.6; T16 5.6,-5.6; T17 6.4,-5.6; U1 -6.4,-6.4; U2 -5.6,-6.4; U3 -4.8,-6.4; U4 -4,-6.4; U5 -3.2,-6.4; U6 -2.4,-6.4; U7 -1.6,-6.4; U8 -0.8,-6.4; U9 0,-6.4; U10 0.8,-6.4; U11 1.6,-6.4; U12 2.4,-6.4; U13 3.2,-6.4; U14 4,-6.4; U15 4.8,-6.4; U16 5.6,-6.4; U17 6.4,-6.4
3.2X2.5_KX-7 = smd 1.3 x 1.1: 1 -1.15,-0.9; 2 1.15,-0.9; 3 1.15,0.9; 4 -1.15,0.9
3.2X1.5 = smd 1 x 1.8: 1 -1.25,0; 2 1.25,0
R0402 = smd 0.6 x 0.7: 1 -0.5,0; 2 0.5,0
MA18-2 = drill 1.016 octagon: 1 -21.59,-1.27; 2 -21.59,1.27; 3 -19.05,-1.27; 4 -19.05,1.27; 5 -16.51,-1.27; 6 -16.51,1.27; 7 -13.97,-1.27; 8 -13.97,1.27; 9 -11.43,-1.27; 10 -11.43,1.27; 11 -8.89,-1.27; 12 -8.89,1.27; 13 -6.35,-1.27; 14 -6.35,1.27; 15 -3.81,-1.27; 16 -3.81,1.27; 17 -1.27,-1.27; 18 -1.27,1.27; 19 1.27,-1.27; 20 1.27,1.27; 21 3.81,-1.27; 22 3.81,1.27; 23 6.35,-1.27; 24 6.35,1.27; 25 8.89,-1.27; 26 8.89,1.27; 27 11.43,-1.27; 28 11.43,1.27; 29 13.97,-1.27; 30 13.97,1.27; 31 16.51,-1.27; 32 16.51,1.27; 33 19.05,-1.27; 34 19.05,1.27; 35 21.59,-1.27; 36 21.59,1.27
SOT95P280X110-6 = smd 1.259 x 0.609: 1 -1.228,0.95; 2 -1.228,0; 3 -1.228,-0.95; 4 1.228,-0.95; 5 1.228,0; 6 1.228,0.95
USB = drill 1: 1 -3.5,12.99; 2 -1,12.99; 3 1,12.99; 4 3.5,12.99 | hole 2.3: -6.57,10.28; 6.57,10.28

### Placement (x,y rotation side)
C1  36.2,26 90 top
C2  37.4,26 90 top
C3  22.2,26.9 180 top
C4  16.7,21 270 top
C5  16.7,11.5 270 top
C6  16.7,12.5 270 top
C7  24.5,2.7 0 top
C8  33.5,2.7 0 top
C9  42,2.7 0 top
C10  51.3,7 90 top
C11  77.25,9.55 90 top
C12  54.5,24.7 180 top
C13  35,26 90 top
C14  16.7,18 270 top
C15  27,2.7 0 top
C16  45,2.7 0 top
C17  76.8,12.45 90 top
C18  41.7,31.1 180 top
C19  38.5,32.9 180 top
C20  22.9,21.1 180 top
C21  36.2,29 0 top
C22  36.2,27.8 0 top
C23  24.6,27.4 90 top
C24  25.8,27.4 90 top
C25  31,29 180 top
C26  33,29 180 top
C27  27,28.2 90 top
C28  27,26.2 90 top
C29  74.8,3.8 0 top
C30  76.8,3.8 0 top
C31  75.4,5.8 0 top
C32  75.4,1.8 0 top
C33  75,3.8 0 top
C34  71.2,20.8 90 top
C35  66.2,20.8 90 top
C36  62.6,20.8 270 top
C37  64.4,20.8 270 top
C38  68.4,20.8 270 top
C39  73.2,20.8 270 top
C40  63.4,20.8 270 top
C41  63.8,26.8 0 top
C42  60.2,26.8 0 top
C43  8.4,26.2 0 top
CON1  2,30 270 top
CON2  14,17 270 top
IC1  47.4,12 90 top
IC2  47.4,22.4 90 top
IC3  32,17 90 top
Q1  32,26.8 0 top
Q2  28.6,27.2 270 top
R1  34.6,28.4 270 top
R2  25.2,25.8 0 top
SV1  30,37 0 top
U2  8.2,29.8 0 top
X1  65,-1 0 top

### Tracks (layer width: path | path; a pad name or v marks a point on that pad's centre or on a via)
+3V3  (via drill 0.2, 0.35)  (59 unrouted)
  Top 0.127: IC3.H14 v30.8,20.6 | IC3.K4 v33.2,12.6 | IC3.R14 v37.2,21.4 | IC3.R10 v37.2,18.2 | IC3.R17 36.8,24.9 C2.1 | IC3.P16 35.6,23 35.6,24.9 C1.1
  Top 0.2: 22.85,26.75 C3.1 | 16.95,12.75 C6.1 | 16.95,11.75 C5.1 | 16.95,21.25 C4.1 | 24.25,2.95 C7.1 | 33.25,2.95 C8.1 | 41.75,2.95 C9.1 | 51.05,6.75 C10.1
  other vias: 52.8,18.9
ADDR0  (1 unrouted)
ADDR1  (1 unrouted)
ADDR2  (2 unrouted)
ADDR3  (2 unrouted)
ADDR4  (2 unrouted)
  Top 0.127: 50.2,14.8 IC1.J8
ADDR5  (2 unrouted)
  Top 0.127: 51,14 IC1.J7
ADDR6  (2 unrouted)
ADDR7  (2 unrouted)
ADDR8  (2 unrouted)
ADDR9  (2 unrouted)
ADDR10  (2 unrouted)
ADDR11  (via drill 0.2)  (2 unrouted)
  Top 0.127: IC2.G3 v49.4,20.4
ADDR13  (via drill 0.2)  (2 unrouted)
  Top 0.127: IC2.G2 v49.4,19.6
ADDR14  (2 unrouted)
ADDR16  (2 unrouted)
ADDR17  (2 unrouted)
CAS  (2 unrouted)
  Top 0.127: IC3.U8 40,16.2
CFIOR_NBS1_NWR1  (1 unrouted)
CFIOW_NBS3_NWR3  (1 unrouted)
DATA0  (via drill 0.2)  (1 unrouted)
  Top 0.127: IC3.R9 v37.2,17.4
DATA1  (via drill 0.2)  (1 unrouted)
  Top 0.127: IC3.P10 v36.4,18.2
DATA2  (via drill 0.2)  (1 unrouted)
  Top 0.127: IC3.N11 v35.6,19
DATA3  (1 unrouted)
  Top 0.127: IC3.U9 40,17
DATA4  (1 unrouted)
DATA5  (via drill 0.2)  (1 unrouted)
  Top 0.127: IC3.P11 v36.4,19
DATA6  (1 unrouted)
  Top 0.127: IC3.U10 40,17.8
DATA7  (1 unrouted)
  Top 0.127: IC3.U11 40,18.6
DATA8  (via drill 0.2)  (1 unrouted)
  Top 0.127: IC3.R11 v37.2,19
DATA9  (1 unrouted)
  Top 0.127: IC3.T11 38,19 40,19
DATA10  (via drill 0.2)  (1 unrouted)
  Top 0.127: IC3.P12 v36.4,19.8
DATA11  (1 unrouted)
  Top 0.127: IC3.U12 40,19.4
DATA12  (1 unrouted)
  Top 0.127: IC3.T12 38,19.8 40,19.8
DATA13  (via drill 0.2)  (1 unrouted)
  Top 0.127: IC3.R12 v37.2,19.8
DATA14  (1 unrouted)
  Top 0.127: IC3.U13 40,20.2
DATA15  (via drill 0.2)  (1 unrouted)
  Top 0.127: IC3.P13 v36.4,20.6
DATA16  (1 unrouted)
  Top 0.127: IC3.U14 40,21
DATA17  (via drill 0.2)  (1 unrouted)
  Top 0.127: IC3.R13 v37.2,20.6
DATA18  (1 unrouted)
  Top 0.127: IC3.U15 40,21.8
DATA19  (1 unrouted)
  Top 0.127: IC3.T14 38,21.4 40,21.4
DATA20  (1 unrouted)
  Top 0.127: IC3.U16 40,22.6
DATA21  (1 unrouted)
  Top 0.127: IC3.T15 38,22.2 40,22.2
DATA22  (1 unrouted)
  Top 0.127: IC3.U17 40,23.4
DATA23  (1 unrouted)
  Top 0.127: IC3.T16 38,23 40,23
DATA24  (via drill 0.2)  (1 unrouted)
  Top 0.127: IC3.R15 v37.2,22.2
  Bottom 0.127: v37.2,22.2 37.6,22.2 37.8,22.4 40,22.4
DATA25  (1 unrouted)
  Top 0.127: IC3.T17 38,23.8 40,23.8
DATA26  (via drill 0.2)  (1 unrouted)
  Top 0.127: IC3.P14 v36.4,21.4
DATA27  (via drill 0.2)  (1 unrouted)
  Top 0.127: IC3.P15 v36.4,22.2
  Bottom 0.127: v36.4,22.2 36.8,22.6 37.2,22.6
DATA28  (via drill 0.2)  (1 unrouted)
  Top 0.127: IC3.N13 v35.6,20.6
DATA29  (via drill 0.2)  (1 unrouted)
  Top 0.127: IC3.R16 v37.2,23
  Bottom 0.127: v37.2,23 37.4,23.2 40,23.2
DATA30  (via drill 0.2)  (1 unrouted)
  Top 0.127: IC3.N15 v35.6,22.2
DATA31  (via drill 0.2)  (1 unrouted)
  Top 0.127: IC3.N14 v35.6,21.4
GND  (via drill 0.2)  (96 unrouted)
  Top 0.127: IC3.T13 v38,20.6 | IC3.N12 v34.8,19 IC3.M12 | IC3.T9 v38,17.4 | IC3.P17 v36.4,23.8 | IC3.M16 v34.8,23 | IC3.J13 v32.4,19.8 IC3.J12 | IC3.C15 v26.8,22.2 | IC3.D11 v27.6,19 IC3.C11 | IC3.E8 v29.4,16.2 | IC3.E6 v29.2,15 | IC3.B7 v26.8,15 | IC3.E3 v28.4,12.6 | IC3.E4 v28.4,12.6 | IC3.D4 v28.4,12.6
  Top 0.2: 22.35,21.05 C20.2 | 38.25,32.65 C19.2 | 16.95,12.25 C6.2 | 16.95,11.25 C5.2 | 16.95,17.75 C14.2 | 16.95,20.75 C4.2 | 24.75,2.95 C7.2 | 27.25,2.95 C15.2 | 33.75,2.95 C8.2 | 42.25,2.95 C9.2 | 45.25,2.95 C16.2 | 51.05,7.25 C10.2 | 53.85,24.55 C12.2
  pour Route2: -1,-1 -1,41 80,41 80,-1
HSE_IN
  Top 0.127: IC3.J17 32,24.75 Q1.1 31.8,26.85 31.8,28.7 C25.1
HSE_OUT  (1 unrouted)
  Top 0.127: IC3.K17 32.8,24.8 32.2,25.4 32.2,26.75 Q1.3
LSE_IN  (1 unrouted)
  Top 0.127: IC3.H17 31.2,23.6 29.8,25 29.8,27.65 29,28.45 Q2.1
LSE_OUT  (1 unrouted)
  Top 0.127: IC3.G17 30.4,23.6 28.6,25.4 Q2.2
N$1  (1 unrouted)
N$2  (1 unrouted)
PLLRCA  (1 unrouted)
  Top 0.127: IC3.L17 33.6,24.8 34,25.2 34,27.3 R1.2
PLLRCB  (1 unrouted)
  Top 0.127: IC3.F17 28,25 26.5,25 R2.2
RAS  (2 unrouted)
SDA10  (2 unrouted)
SDCK  (via drill 0.2)  (2 unrouted)
  Top 0.127: IC3.U7 40,15.4 | IC2.F2 v48.6,19.6
SDCKE  (via drill 0.2)  (2 unrouted)
  Top 0.127: IC3.P9 v36.4,17.4 | IC2.F3 v48.6,20.4
SDCS  (2 unrouted)
SDWE  (2 unrouted)
  Top 0.127: IC3.T8 38,16.6 40,16.6
VDDCORE  (via drill 0.2)  (15 unrouted)
  Top 0.127: IC3.T10 v38,18.2 | IC3.L16 34,23 34,24.4 35,25.4 C13.1
  Top 0.2: 23.35,21.05 C20.1 | 38.75,32.65 C19.1 | 16.95,18.25 C14.1 | 26.75,2.95 C15.1 | 44.75,2.95 C16.1